# EAGLE design OpenCTD-V02 (EAGLE 8.5.2)
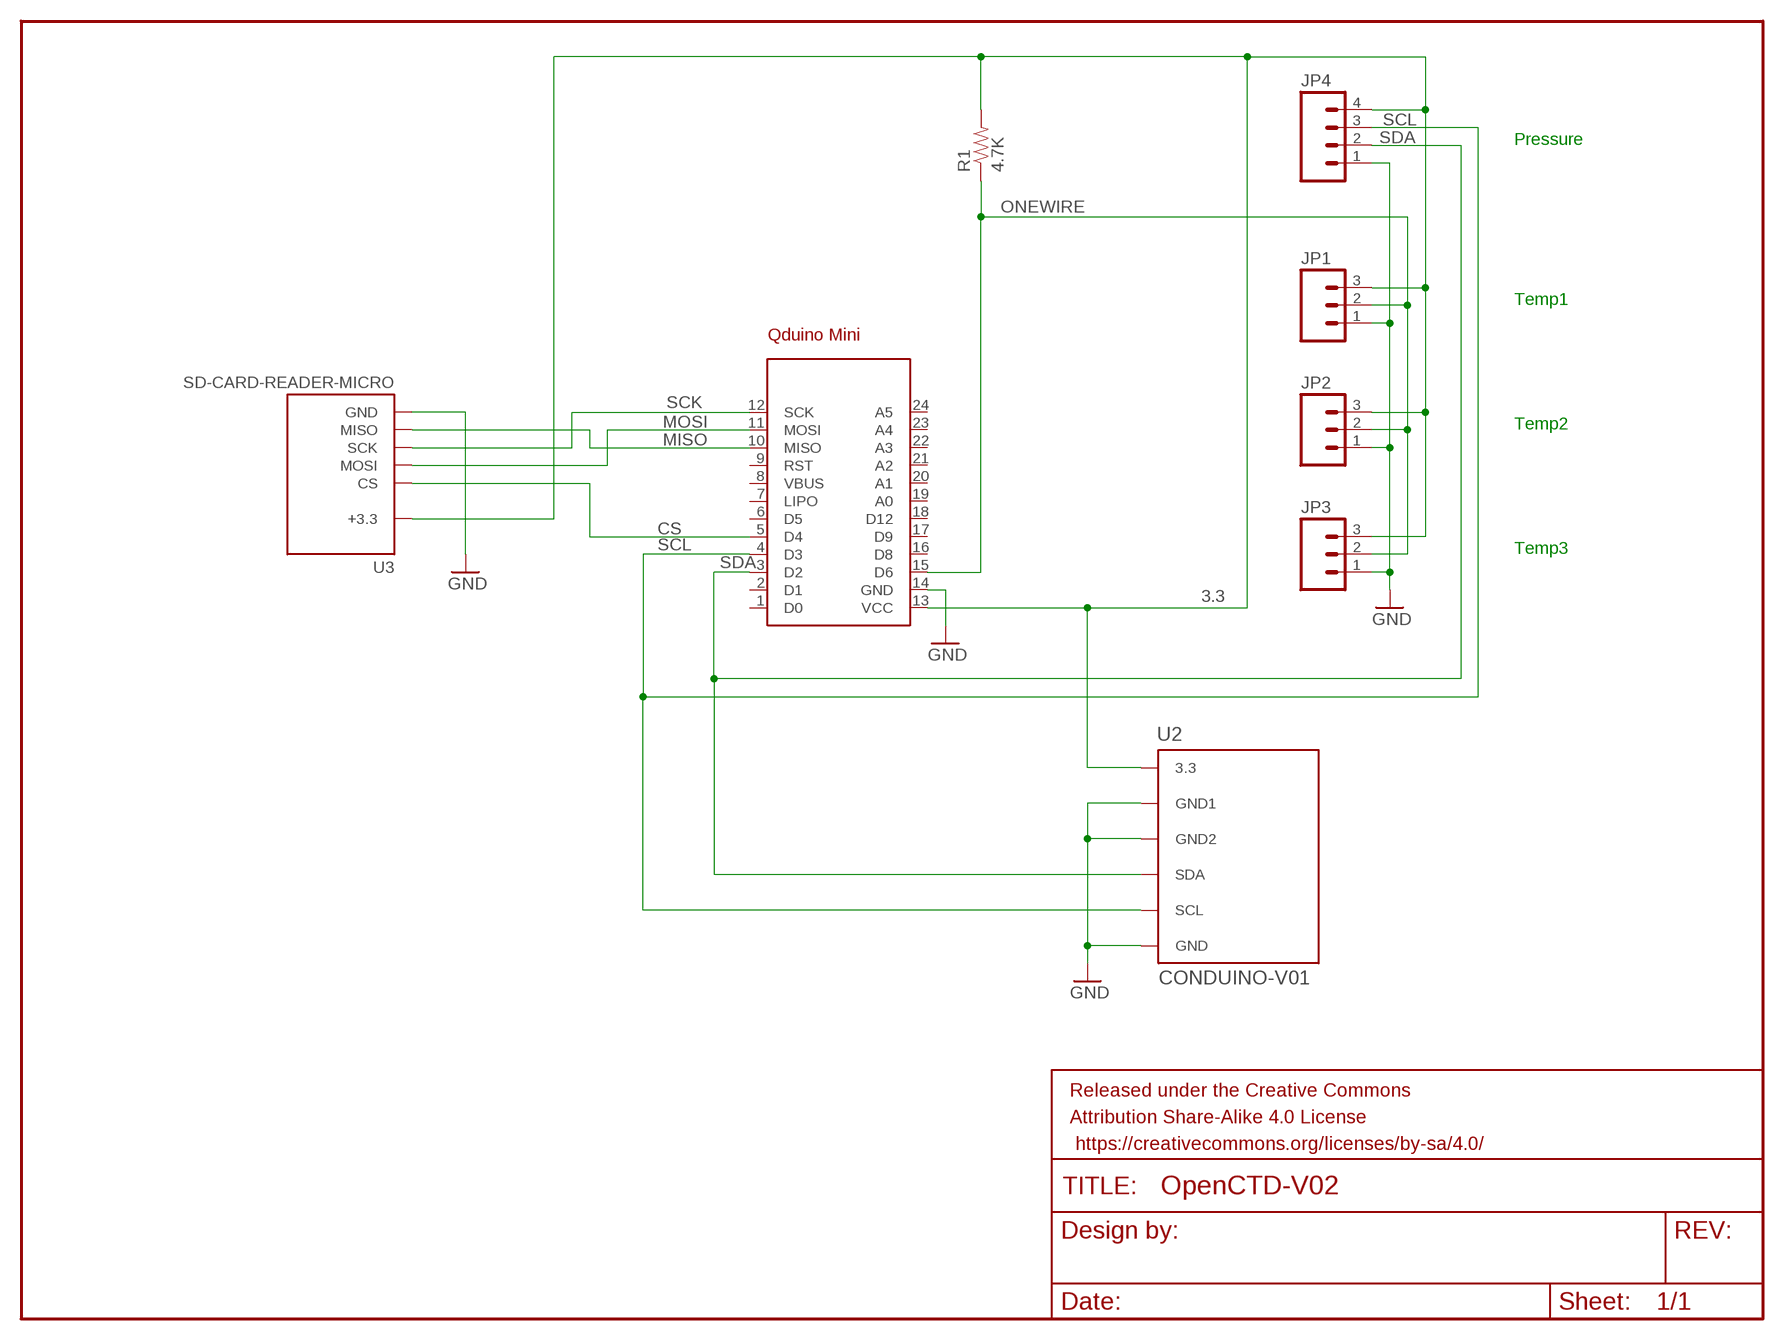
[diagram p0: schematic, sheet 1]

## Parts
FRAME1  FRAME-LETTER  [CREATIVE_COMMONS]
JP1  M031X03_NO_SILK  [1X03_NO_SILK]
JP2  M031X03_NO_SILK  [1X03_NO_SILK]
JP3  M031X03_NO_SILK  [1X03_NO_SILK]
JP4  M041X04_NO_SILK  [1X04_NO_SILK]
R1  4.7K  RESISTORPTH-1/4W  [AXIAL-0.4]
U1  QDUINO_MINI  [QDUINO_MINI]
U2  CONDUINO-V01  [CONDUINO-V01]
U3  SD-CARD-READER-MICRO  [MICROSD_MOLEX]

## Nets
3.3: JP1.3 JP2.3 JP3.3 JP4.4 R1.P$2 U1.13(VCC) U2.6(3.3) U3.P$4(+3.3)
CS: U1.5(D4) U3.P$2(CS)
GND: JP1.1 JP2.1 JP3.1 JP4.1 U1.14(GND) U2.3(GND) U2.4(GND1) U2.5(GND2) U3.P$6(GND) U3.P$9(GND) U3.P$10(GND) U3.P$11(GND) U3.P$12(GND)
MISO: U1.10(MISO) U3.P$7(MISO)
MOSI: U1.11(MOSI) U3.P$3(MOSI)
ONEWIRE: JP1.2 JP2.2 JP3.2 R1.P$1 U1.15(D6)
SCK: U1.12(SCK) U3.P$5(SCK)
SCL: JP4.3 U1.4(D3) U2.1(SCL)
SDA: JP4.2 U1.3(D2) U2.2(SDA)
Unconnected: U1.1(D0) U1.2(D1) U1.6(D5) U1.7(LIPO) U1.8(VBUS) U1.9(RST) U1.16(D8) U1.17(D9) U1.18(D12) U1.19(A0) U1.20(A1) U1.21(A2) U1.22(A3) U1.23(A4) U1.24(A5)

## Notes on the sheet
- Pressure
- Temp1
- Temp2
- Temp3

## Library data of the parts
FRAME1 = SparkFun-Aesthetics:FRAME-LETTER: Schematic Frame Standard 8.5x11 US Letter frame
JP1-JP3 = SparkFun-Connectors:M03: Header 3 Standard 3-pin 0.1" header. Use with straight break away headers (SKU : PRT-00116), right angle break away headers (PRT-00553), swiss pins (PRT-00743), machine pins (PRT-00117), and female headers (PRT-00115). Molex polarized connector foot print use with SKU : PRT-08232 with associated crimp pins and housings.
JP4 = SparkFun-Connectors:M04: Header 4 Standard 4-pin 0.1" header. Use with straight break away headers (SKU : PRT-00116), right angle break away headers (PRT-00553), swiss pins (PRT-00743), machine pins (PRT-00117), and female headers (PRT-00115). Molex polarized connector foot print use with SKU : PRT-08231 with associated crimp pins and housings. 1MM SMD Version SKU: PRT-10208
R1 = SparkFun-Resistors:RESISTOR: Resistor Basic schematic elements and footprints for 0603, 1206, and PTH resistors.
U1 = SparkFun-Boards:QDUINO_MINI
U2 = KDA:CONDUINO-V01
U3 = KDA:SD-CARD-READER-MICRO

## Board
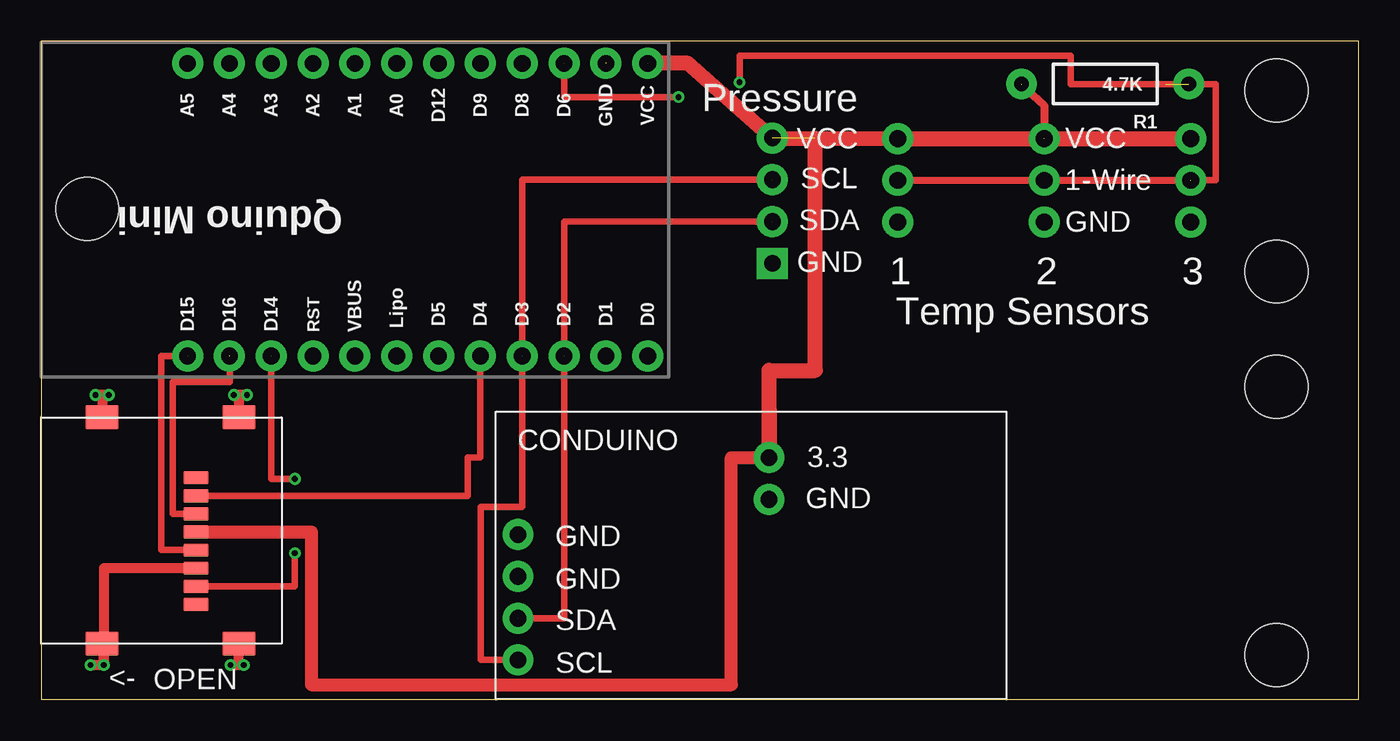
[diagram p1: board, top side]
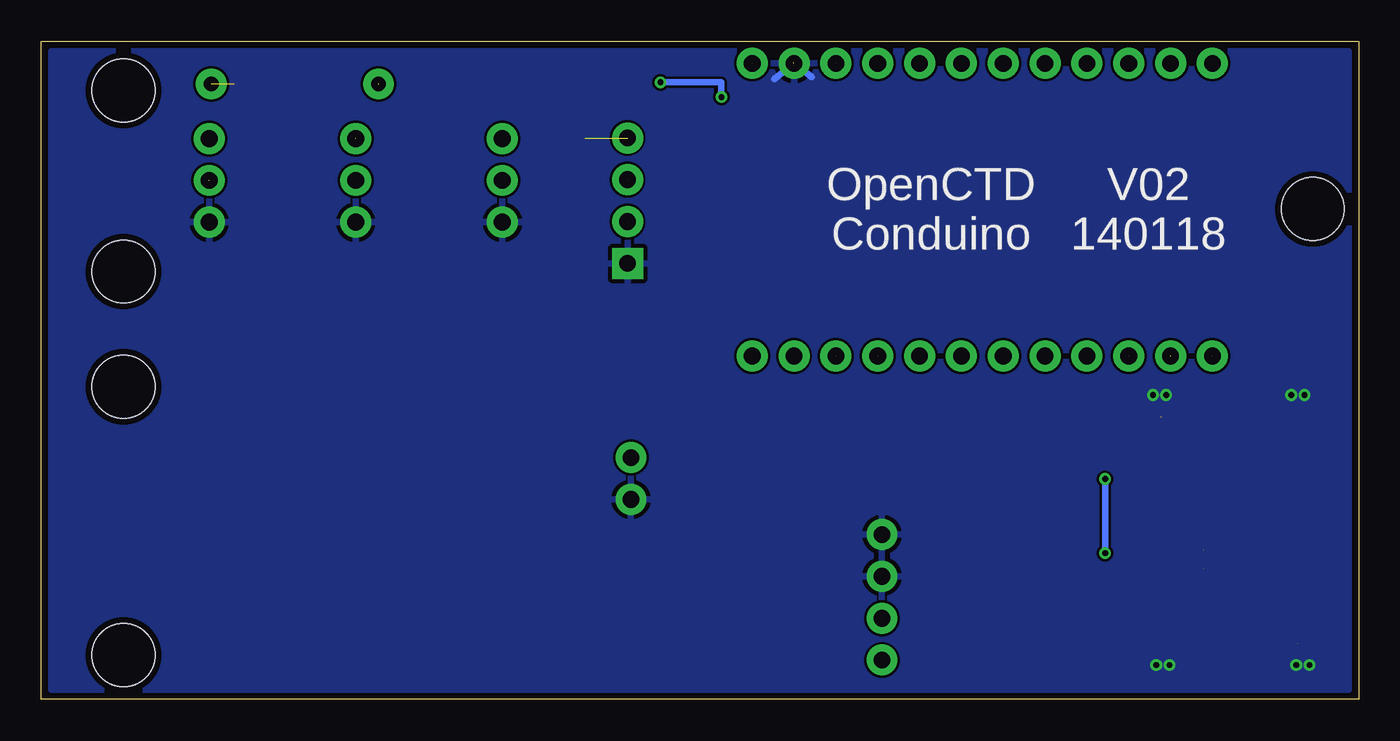
[diagram p2: board, bottom side, seen from below]

Size 80 x 40 mm. Coordinates in mm from the lower left corner, seen from the top.
Outline: 0,0 80,0 80,40 0,40 0,0
Copper layers (1*16): Top 0.0356mm / dielectric 1.5011mm / Bottom 0.0356mm
Design rules "Oshpark_mm": minimum track width 0.15mm, minimum drill 0.33mm, track to track 0.15mm, track to pad 0.15mm, pad to pad 0.15mm, via to via 0.15mm, smd to smd 0.15mm, copper to edge 0.38mm, drill to drill 0.15mm, minimum pad ring 7mil, minimum via ring 7mil, stop-mask expansion 3mil, vias tented up to drill 0mil, thermal gap 10mil
Holes 3.81 mm at 75,37 75,26 75,19 75,2.7 2.8,29.8

### Footprints (pad centres in the part's own frame; a part is rotated, then mirrored left to right if it is on the bottom)
1X03_NO_SILK = drill 1.016 pad 1.88: 1 0,0; 2 2.54,0; 3 5.08,0
1X04_NO_SILK = drill 1.016 pad 1.88 square: 1 0,0 | drill 1.016 pad 1.88: 2 2.54,0; 3 5.08,0; 4 7.62,0
AXIAL-0.4 = drill 0.9 pad 1.88: P$1 -5.08,0; P$2 5.08,0
QDUINO_MINI = drill 1.016 pad 1.88: 1 1.27,1.27; 2 1.27,3.81; 3 1.27,6.35; 4 1.27,8.89; 5 1.27,11.43; 6 1.27,13.97; 7 1.27,16.51; 8 1.27,19.05; 9 1.27,21.59; 10 1.27,24.13; 11 1.27,26.67; 12 1.27,29.21; 13 19.05,1.27; 14 19.05,3.81; 15 19.05,6.35; 16 19.05,8.89; 17 19.05,11.43; 18 19.05,13.97; 19 19.05,16.51; 20 19.05,19.05; 21 19.05,21.59; 22 19.05,24.13; 23 19.05,26.67; 24 19.05,29.21
CONDUINO-V01 = drill 1.016 pad 1.88: 1 1.35,2.4; 2 1.35,4.94; 3 1.35,7.48; 4 1.35,10.02; 5 16.59,12.16; 6 16.59,14.7
MICROSD_MOLEX = smd 0.8 x 1.5: P$1 10.08,2.6; P$2 8.98,2.6; P$3 7.88,2.6; P$4 6.78,2.6; P$5 5.68,2.6; P$6 4.58,2.6; P$7 3.48,2.6; P$8 2.38,2.6 | smd 1.45 x 2: P$9 0,0; P$10 13.75,0; P$11 13.75,8.3; P$12 0,8.3

### Placement (x,y rotation side)
FRAME1  0,0 0 top
JP1  69.8,29 90 top
JP2  52,29 90 top
JP3  60.9,29 90 top
JP4  44.4,26.5 90 top
R1  64.6,37.4 180 top
U1  38.1,19.6 90 top
U2  27.6,0 0 top
U3  12,3.4 90 top

### Tracks (layer width: path | path; a pad name or v marks a point on that pad's centre or on a via)
3.3  (5 unrouted)
  Top 0.5: R1.P$2 60.9,36.11 60.9,34.1
  Top 0.8: U3.P$4 16.4,10.18 16.4,0.9 41.9,0.9 41.9,14.7 U2.6
  Top 0.9: JP4.4 JP2.3 JP3.3 JP1.3 | JP4.4 39.27,38.65 U1.13 | 44.19,17.65 U2.6 44.19,20 47,20 47,34.1
CS
  Top 0.4: U3.P$2 25.9,12.38 25.9,14.7 26.67,14.7 U1.5
GND  (via drill 0.35)  (4 unrouted)
  Top 0.6: v4.1,18.5 v3.3,18.5 3.7,18.5 U3.P$11 | v12.5,18.5 v11.7,18.5 12,18.5 U3.P$10 | v11.5,2.1 v12.3,2.1 12,2.1 U3.P$9 | v3,2.1 v3.8,2.1 | v3.8,2.1 3.8,3.39 U3.P$12 | U3.P$6 3.8,7.97 v3.8,2.1
  Bottom 0.4: 34.3,38.7 33.2,37.8 | 34.3,38.67 35.5,37.7
  pour Bottom (isolate 0.13): 0.6,0.6 0.6,39.4 79.4,39.4 79.4,0.6
MISO  (via drill 0.35)  (1 unrouted)
  Top 0.4: U1.10 13.98,13.4 v15.4,13.4 | v15.4,8.9 15.4,6.88 U3.P$7
  Bottom 0.4: v15.4,13.4 v15.4,8.9
MOSI  (1 unrouted)
  Top 0.4: U3.P$3 8,11.28 8,19.3 11.44,19.3 U1.11
ONEWIRE  (via drill 0.35)  (4 unrouted)
  Top 0.4: JP1.2 71.3,31.55 71.3,37.4 68.28,37.4 | 68.3,37.4 62.5,37.4 62.5,39.1 42.4,39.1 v42.4,37.5 | U1.15 31.76,36.6 v38.7,36.6
  Top 0.42: JP1.2 JP3.2 JP2.2
  Bottom 0.4: v38.7,36.6 38.7,37.5 v42.4,37.5
SCK  (2 unrouted)
  Top 0.4: U3.P$5 7.3,9.08 7.3,20.88 U1.12
SCL  (2 unrouted)
  Top 0.4: U1.4 29.21,31.58 JP4.3 | U1.4 29.21,11.7 26.7,11.7 26.7,2.4 U2.1
SDA  (4 unrouted)
  Top 0.4: JP4.2 31.75,29.04 U1.3 | U1.3 31.76,4.94 U2.2

### Text on the board
tPlace: Pressure | VCC | VCC | SCL | 1-Wire | SDA | GND | GND | 1 | 2 | 3 | Temp Sensors | <- | OPEN
bPlace: V02 / 140118 | OpenCTD / Conduino